# EAGLE design Meccano (EAGLE 7.5.0)
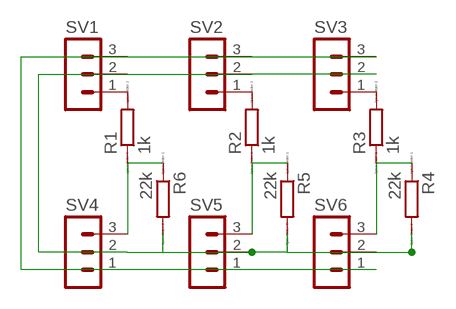
[diagram p0: schematic, sheet 1]

## Parts
R1  1k  R0204/7  [0204/7]
R2  1k  R0204/7  [0204/7]
R3  1k  R0204/7  [0204/7]
R4  22k  R0204/7  [0204/7]
R5  22k  R0204/7  [0204/7]
R6  22k  R0204/7  [0204/7]
SV1  MA03-1  [MA03-1]
SV2  MA03-1  [MA03-1]
SV3  MA03-1  [MA03-1]
SV4  MA03-1  [MA03-1]
SV5  MA03-1  [MA03-1]
SV6  MA03-1  [MA03-1]

## Nets
5V: R4.2 R5.2 R6.2 SV1.2 SV2.2 SV3.2 SV4.2 SV5.2 SV6.2
GND: SV1.3 SV2.3 SV3.3 SV4.1 SV5.1 SV6.1
N$1: R1.2 SV1.1
N$2: R2.2 SV2.1
N$3: R3.2 SV3.1
N$4: R3.1 R4.1 SV6.3
N$5: R2.1 R5.1 SV5.3
N$6: R1.1 R6.1 SV4.3

## Library data of the parts
R1-R6 = eagle-ltspice:R: RESISTOR, European symbol; SPICEMODEL: NONE; SPICEPREFIX: R
SV1-SV6 = con-lstb:MA03-1: PIN HEADER; OC_FARNELL: unknown; OC_NEWARK: unknown

## Board
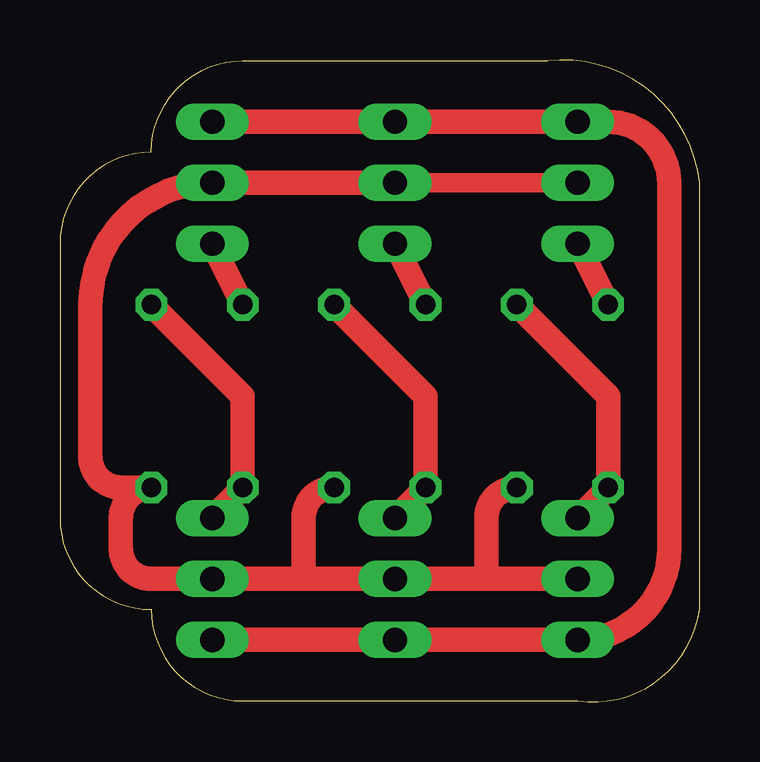
[diagram p1: board, top side]
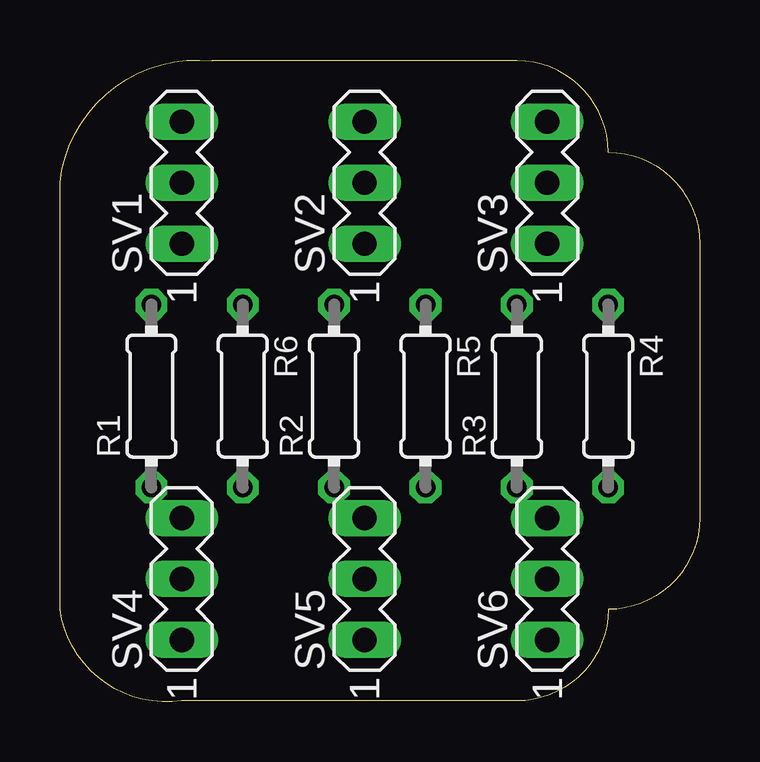
[diagram p2: board, bottom side, seen from below]

Size 26.67 x 26.75 mm. Coordinates in mm from the lower left corner, seen from the top.
Outline: 26.67,21.63 arc90 20.32,26.71 7.62,26.71 arc90 3.81,22.9 arc90 0,19.09 0,7.66 arc90 3.81,3.85 arc90 7.62,0.04 21.59,0.04 arc90 26.67,3.85 26.67,21.63
Copper layers (1*16): Top 0.035mm / dielectric 1.5mm / Bottom 0.035mm
Design rules "default": minimum track width 10mil, minimum drill 24mil, track to track 8mil, track to pad 8mil, pad to pad 8mil, via to via 8mil, smd to smd 8mil, copper to edge 40mil, drill to drill 8mil, minimum pad ring 10mil, minimum via ring 8mil, stop-mask expansion 4mil, vias tented up to drill 0mil, thermal gap 10mil

### Footprints (pad centres in the part's own frame; a part is rotated, then mirrored left to right if it is on the bottom)
0204/7 = drill 0.813 octagon: 1 -3.81,0; 2 3.81,0
MA03-1 = drill 1.016 long: 1 -2.54,0; 2 0,0; 3 2.54,0

### Placement (x,y rotation side)
R1  22.86,12.74 90 bottom
R2  15.24,12.74 90 bottom
R3  7.62,12.74 90 bottom
R4  3.81,12.74 270 bottom
R5  11.43,12.74 270 bottom
R6  19.05,12.74 270 bottom
SV1  21.59,21.63 90 bottom
SV2  13.97,21.63 90 bottom
SV3  6.35,21.63 90 bottom
SV4  21.59,5.12 90 bottom
SV5  13.97,5.12 90 bottom
SV6  6.35,5.12 90 bottom

### Tracks (layer width: path | path; a pad name or v marks a point on that pad's centre or on a via)
5V
  Top 0.813: SV1.2 SV2.2
  Top 1.016: SV2.2 SV3.2 arc90 1.27,16.55 1.27,10.2 arc90 2.54,8.93 R4.2 arc90 2.54,7.66 2.54,6.39 arc90 3.81,5.12 SV6.2 10.16,5.12 | 17.78,5.12 SV5.2 10.16,5.12 | 17.78,5.12 SV4.2 | R5.2 arc90 10.16,7.66 10.16,5.12 | R6.2 arc90 17.78,7.66 17.78,5.12
GND
  Top 0.813: SV1.3 SV2.3 SV3.3
  Top 1.016: SV5.1 SV4.1 | SV6.1 SV4.1 | SV3.3 22.86,24.17 arc-90 25.4,21.63 25.4,6.39 arc-90 SV4.1
N$1
  Top 1.016: R1.2 SV1.1
N$2
  Top 1.016: R2.2 SV2.1
N$3
  Top 1.016: R3.2 SV3.1
N$4
  Top 1.016: SV6.3 R3.1 7.62,12.74 R4.1
N$5
  Top 1.016: R5.1 15.24,12.74 R2.1 SV5.3
N$6
  Top 1.016: SV4.3 R1.1 22.86,12.74 R6.1